# EAGLE design SparkFun_AVR_Stick (EAGLE 7.2.0)
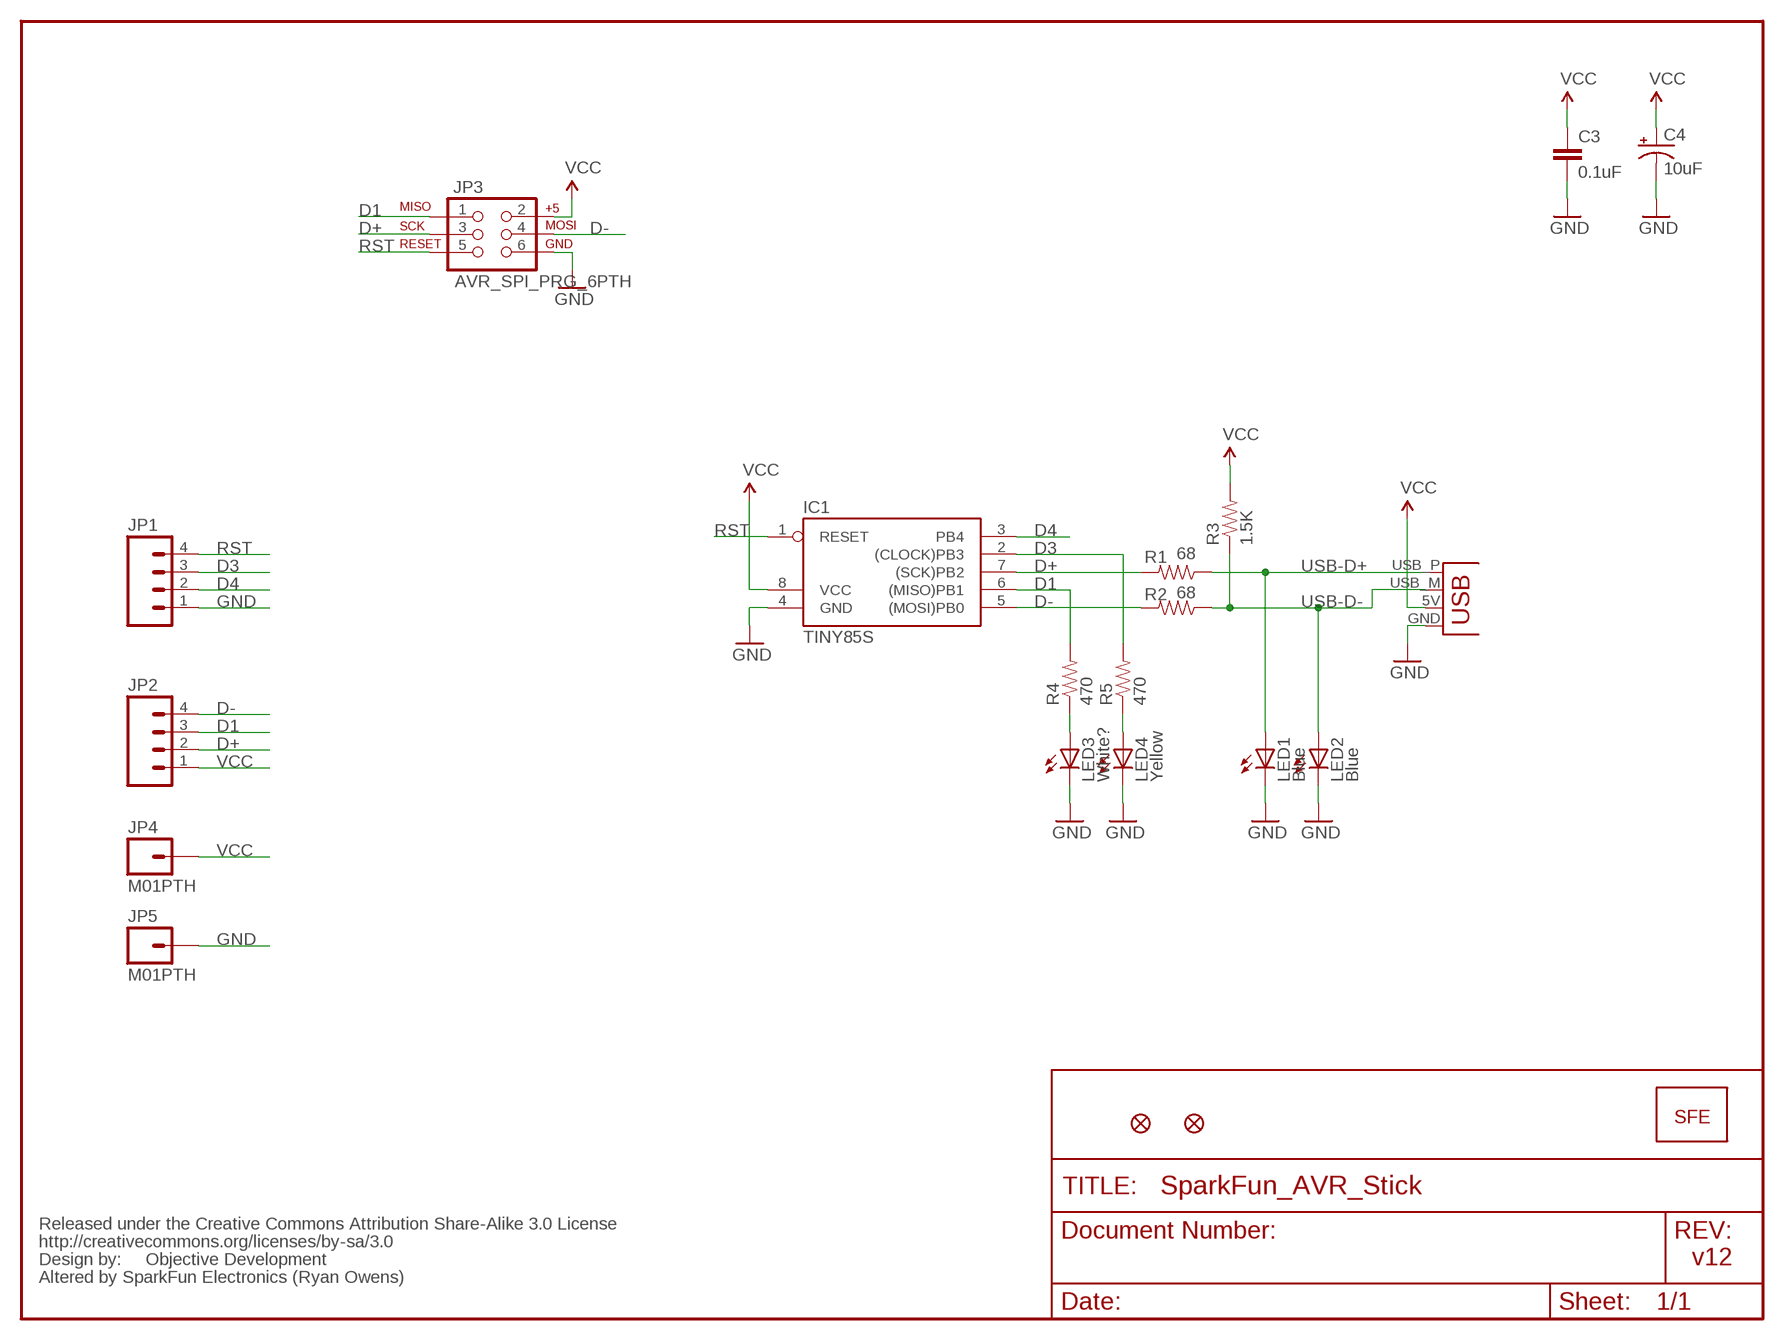
[diagram p0: schematic, sheet 1]

## Parts
C3  0.1uF  CAP0402-CAP  [0402-CAP]
C4  10uF  CAP_POL1206  [EIA3216]
IC1  TINY85S  [SOIC8]
JP1  M04PTH  [1X04]
JP2  M04PTH  [1X04]
JP3  AVR_SPI_PRG_6PTH  [2X3]
JP4  M01PTH  [1X01]
JP5  M01PTH  [1X01]
LED1  Blue  LED0603  [LED-0603]
LED2  Blue  LED0603  [LED-0603]
LED3  White?  LED0603  [LED-0603]
LED4  Yellow  LED0603  [LED-0603]
R1  68  RESISTOR0402-RES  [0402-RES]
R2  68  RESISTOR0402-RES  [0402-RES]
R3  1.5K  RESISTOR0402-RES  [0402-RES]
R4  470  RESISTOR0402-RES  [0402-RES]
R5  470  RESISTOR0402-RES  [0402-RES]
U$1  LOGO-SFESK  [SFE-LOGO-FLAME]
U$2  FIDUCIAL1X2  [FIDUCIAL-1X2]
U$3  FIDUCIAL1X2  [FIDUCIAL-1X2]
U$4  CREATIVE_COMMONS  [CREATIVE_COMMONS]
X1  USBPCB  [USB-A-PCB]

## Nets
D1: IC1.6((MISO)PB1) JP2.3 JP3.1 R4.2
D3: IC1.2((CLOCK)PB3) JP1.3 R5.2
D4: IC1.3(PB4) JP1.2
D+: IC1.7((SCK)PB2) JP2.2 JP3.3 R1.2
D-: IC1.5((MOSI)PB0) JP2.4 JP3.4 R2.2
GND: C3.2 C4.C(-) IC1.4(GND) JP1.1 JP3.6 JP5.1 LED1.C LED2.C LED3.C LED4.C X1.GND
N$7: LED3.A R4.1
N$9: LED4.A R5.1
RST: IC1.1(RESET) JP1.4 JP3.5
USB-D+: LED1.A R1.1 X1.USB_P(D+)
USB-D-: LED2.A R2.1 R3.1 X1.USB_M(D-)
VCC: C3.1 C4.A(+) IC1.8(VCC) JP2.1 JP3.2 JP4.1 R3.2 X1.5V(VBUS)

## Notes on the sheet
- Objective Development | v12
- Altered by SparkFun Electronics (Ryan Owens)

## Library data of the parts
C3 = SparkFun:CAP: Capacitor Standard 0603 ceramic capacitor, and 0.1" leaded capacitor.
C4 = SparkFun:CAP_POL: Capacitor Polarized These are standard SMD and PTH capacitors. Normally 10uF, 47uF, and 100uF in electrolytic and tantalum varieties. Always verify the external diameter of the through hole cap, it varies with capacity, voltage, and manufacturer. The EIA devices should be standard.
IC1 = atmel:TINY85: MICROCONTROLLER 1K ROM 128 bytes RAM 128 bytes EEPROM
JP1 JP2 = SparkFun:M04: Header 4 Standard 4-pin 0.1" header. Use with straight break away headers (SKU : PRT-00116), right angle break away headers (PRT-00553), swiss pins (PRT-00743), machine pins (PRT-00117), and female headers (PRT-00115). Molex polarized connector foot print use with SKU : PRT-08231 with associated crimp pins and housings.
JP3 = SparkFun:AVR_SPI_PRG_6: AVR ISP 6 Pin This is the reduced ISP connector for AVR programming. Common on Arduino. This footprint will take up less PCB space and can be used with a 10-pin to 6-pin adapter such as SKU: BOB-08508
JP4 JP5 = SparkFun:M01: Header 1 Standard 1-pin 0.1" header. Use with straight break away headers (SKU : PRT-00116), right angle break away headers (PRT-00553), swiss pins (PRT-00743), machine pins (PRT-00117), and female headers (PRT-00115).
LED1-LED4 = SparkFun:LED: LEDs Standard schematic elements and footprints for 5mm, 3mm, 1206, and 0603 sized LEDs. 5mm - Spark Fun Electronics SKU : COM-00529 (and others)
R1-R5 = SparkFun:RESISTOR: Resistor Basic schematic elements and footprints for 0603, 1206, and PTH 1/10th watt (small) resistors.
U$1 = SparkFun:LOGO-SFE: Spark Fun Electronics PCB Logo This is the standard Spark Fun Electronics PCB logo.
U$2 U$3 = SparkFun:FIDUCIAL: Fiducial Alignment Points Various fiducial points for machine vision alignment.
U$4 = SparkFun:CREATIVE_COMMONS
X1 = SparkFun:USB: USB Connectors USB-B-PTH is fully proven SKU : PRT-00139 USB-miniB is fully proven SKU : PRT-00587 USB-A-PCB is untested. USB-A-H is throughly reviewed, but untested. Spark Fun Electronics SKU : PRT-00437 USB-B-SMT is throughly reviewed, but untested. Needs silkscreen touching up. USB-A-S has not been used/tested USB-MB-H has not been used/tested

## Board
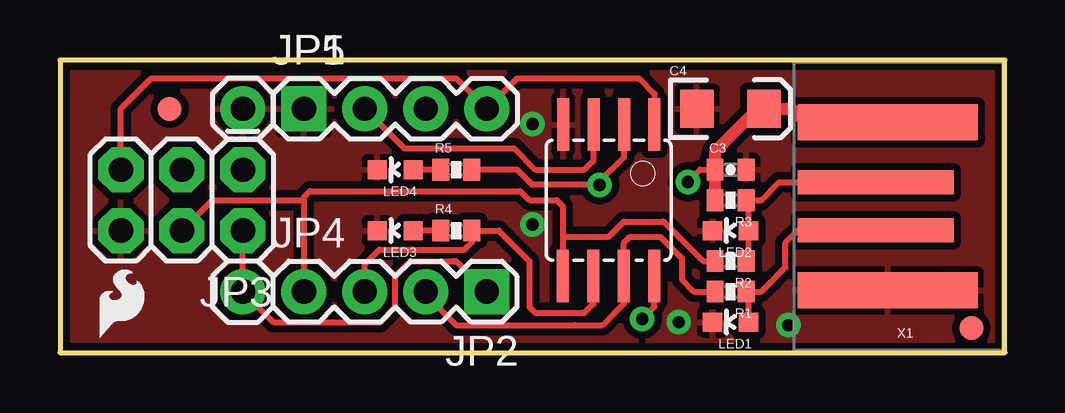
[diagram p1: board, top side]
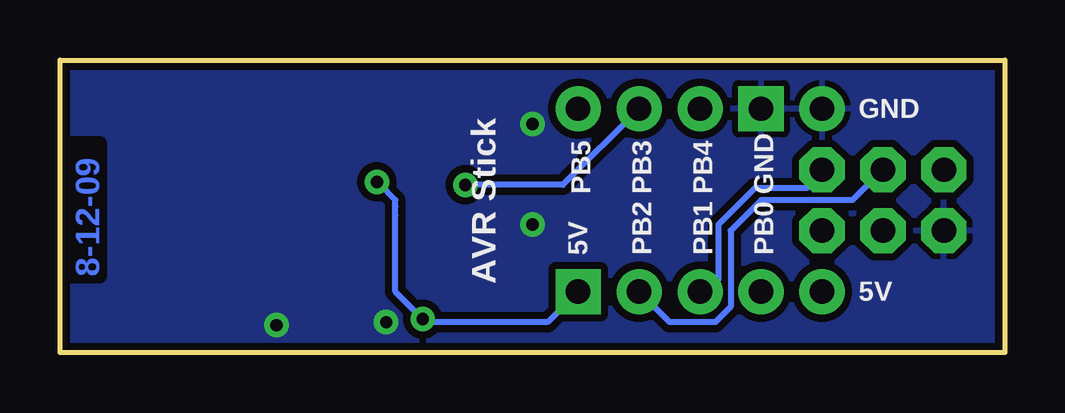
[diagram p2: board, bottom side, seen from below]

Size 39.37 x 12.19 mm. Coordinates in mm from the lower left corner, seen from the top.
Outline: 0,0 39.37,0 39.37,12.19 0,12.19 0,0
Copper layers (1*16): Top 0.035mm / dielectric 1.5mm / Bottom 0.035mm
Design rules "SparkFun": minimum track width 8mil, minimum drill 20mil, track to track 8mil, track to pad 8mil, pad to pad 8mil, via to via 8mil, smd to smd 8mil, copper to edge 10mil, drill to drill 8mil, minimum pad ring 12mil, minimum via ring 10mil, stop-mask expansion 4mil, vias tented up to drill 25mil, thermal gap 10mil

### Footprints (pad centres in the part's own frame; a part is rotated, then mirrored left to right if it is on the bottom)
0402-CAP = smd 0.7 x 0.9: 1 -0.65,0; 2 0.65,0
EIA3216 = smd 1.4 x 1.6: A 1.4,0; C -1.4,0
SOIC8 = smd 0.5 x 2.2: 1 -1.905,-3.154; 2 -0.645,-3.154; 3 0.625,-3.154; 4 1.895,-3.154; 5 1.905,3.154; 6 0.635,3.154; 7 -0.635,3.154; 8 -1.905,3.154
1X04 = drill 1.016 pad 1.88 square: 1 0,0 | drill 1.016 pad 1.88: 2 2.54,0; 3 5.08,0; 4 7.62,0
2X3 = drill 1.016 pad 1.88 octagon: 1 0,0; 2 0,2.54; 3 2.54,0; 4 2.54,2.54; 5 5.08,0; 6 5.08,2.54
1X01 = drill 1.016 pad 1.88: 1 0,0
LED-0603 = smd 0.8 x 0.8: A 0,-0.75; C 0,0.75
0402-RES = smd 0.7 x 0.9: 1 -0.65,0; 2 0.65,0
FIDUCIAL-1X2 = smd 1 x 1: 1 0,0
USB-A-PCB = smd 7.5 x 1.5: 5V -0.2,-3.5; GND -0.2,3.5 | smd 6.5 x 1: USB_M 0.3,-1; USB_P 0.3,1

### Placement (x,y rotation side)
C3  27.94,7.62 0 top
C4  27.94,10.16 0 top
IC1  22.86,6.35 180 top
JP1  10.16,10.16 0 top
JP2  17.78,2.54 180 top
JP3  7.62,7.62 180 top
JP4  7.62,2.54 0 top
JP5  7.62,10.16 0 top
LED1  27.94,1.27 90 top
LED2  27.94,5.08 90 top
LED3  13.97,5.08 90 top
LED4  13.97,7.62 90 top
R1  27.94,2.54 180 top
R2  27.94,3.81 180 top
R3  27.94,6.35 180 top
R4  16.51,5.08 0 top
R5  16.51,7.62 0 top
U$1  1.65,0.64 0 top
U$2  37.97,1.02 0 top
U$3  4.57,10.16 0 top
U$4  21.59,-10.16 0 top  (outside the outline)
X1  34.29,6.1 180 top

### Tracks (layer width: path | path; a pad name or v marks a point on that pad's centre or on a via)
D1
  Top 0.254: JP2.3 12.7,3.68 13.21,4.19 13.31,4.29 14.61,4.29 16.87,4.29 16.89,4.32 17.16,4.59 R4.2 18.29,5.08 19.56,3.81 19.56,2.03 19.56,1.91 19.68,1.78 19.81,1.65 19.94,1.65 21.84,1.65 21.97,1.78 22.22,2.03 IC1.6
  Bottom 0.254: JP3.1 7.62,7.49 8.26,6.86 10.41,6.86 11.05,6.22 11.94,5.33 11.94,3.81 11.94,3.05 12.45,2.54 JP2.3
D3  (via drill 0.51)
  Top 0.254: R5.2 19.05,7.62 19.68,6.99 v22.48,6.99 | v22.48,6.99 v22.49,7 | v22.48,6.99 22.48,7.11 23.5,8.14 IC1.2
  Bottom 0.254: JP1.3 18.41,6.99 v22.48,6.99
D4
  Top 0.254: IC1.3 22.23,8.01 21.84,7.62 19.81,7.62 18.92,8.51 14.35,8.51 14.22,8.64 JP1.2
D+
  Top 0.254: R1.2 26.42,2.54 25.91,3.05 25.91,3.94 25.02,4.83 23.75,4.83 23.5,4.57 IC1.7 23.5,2.03 23.11,1.65 22.61,1.14 21.46,1.14 16.51,1.14 15.37,2.29 15.24,2.41 JP2.2
  Bottom 0.254: JP3.3 6.35,6.35 10.16,6.35 11.43,5.08 11.43,1.91 12.06,1.27 13.97,1.27 JP2.2
D-
  Top 0.254: R2.2 26.8,3.81 25.15,5.46 23.5,5.46 22.86,4.83 20.95,4.83 | JP3.4 6.35,6.35 10.16,6.35 | 10.16,6.35 JP2.4 | 10.16,6.35 10.16,6.48 10.41,6.73 19.18,6.73 19.56,6.35 20.7,6.35 20.95,6.1 20.95,5.46 20.95,4.83 | 20.95,4.83 IC1.5
GND  (via drill 0.51)
  other vias: 19.68,9.53 19.68,5.33 30.35,1.14 25.78,1.27
  pour Bottom (isolate 0.305): 0,12.19 39.37,12.19 39.37,0 0,0
  pour Top (isolate 0.305): 0,0 0,12.19 39.37,12.19 39.37,0
N$7
  Top 0.254: R4.1 LED3.A
N$9
  Top 0.254: R5.1 LED4.A
RST
  Top 0.254: IC1.1 24.77,10.79 24.13,11.43 19.05,11.43 JP1.4 16.51,11.43 3.81,11.43 2.54,10.16 JP3.5
USB-D+
  Top 0.254: LED1.A 28.69,2.4 28.7,2.41 28.59,2.52 R1.1 29.21,2.54 29.53,2.86 29.59,2.92 29.84,3.17 30.23,3.56 30.23,4.06 30.23,4.57 30.75,5.1 X1.USB_P
USB-D-
  Top 0.254: R2.1 28.7,3.92 28.7,4.83 28.7,5.07 LED2.A 28.7,5.09 28.7,5.33 28.7,6.24 R3.1 29.21,6.35 29.96,7.1 X1.USB_M
VCC  (via drill 0.51)
  Top 0.254: IC1.8 24.77,1.91 v24.26,1.4 | JP2.1 16.64,3.68 16.51,3.81 16.38,3.81 14.61,3.81 14.48,3.68 13.97,3.17 13.97,1.91 13.33,1.27 8.89,1.27 JP4.1 JP3.2 | C3.1 26.67,7.62 v26.16,7.11
  Top 0.508: R3.2 C3.1 27.3,7.63 27.3,8.38 29.08,10.16 C4.A 30.35,10.16 30.48,10.16 31.04,9.6 X1.5V
  Bottom 0.254: JP2.1 19.05,1.27 24.13,1.27 v24.26,1.4 25.4,2.54 25.4,5.71 25.4,6.1 25.4,6.35 26.04,6.99 v26.16,7.11

### Text on the board
Bottom: 8-12-09
bPlace: GND | AVR Stick | GND | PB4 | PB3 | PB5 | PB0 | PB1 | PB2 | 5V | 5V
tValues: Objective Development | Altered by SparkFun Electronics (Ryan Owens)